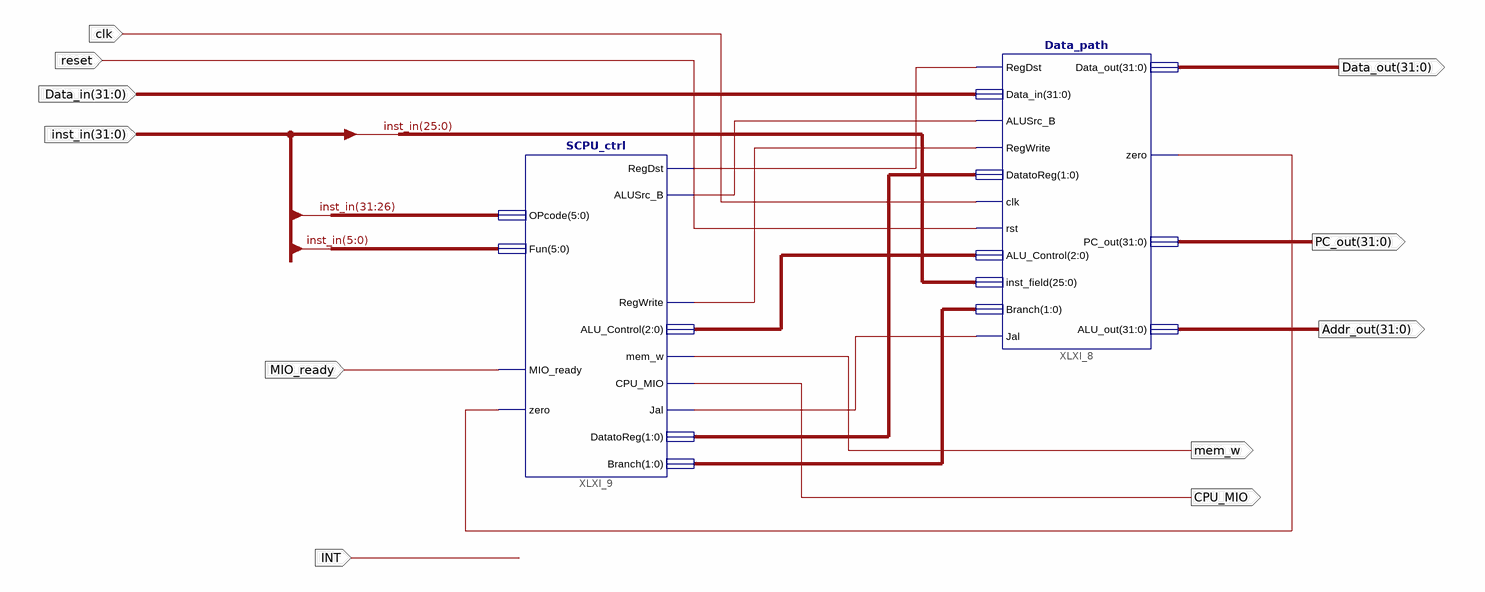
[diagram p0: schematic sheet 1]
// Xilinx ISE schematic SCPU.sch (kintex7) as structural Verilog: 2 symbols, 11 ports
module SCPU (
  input  MIO_ready,
  input  [31:0] inst_in,
  input  [31:0] Data_in,
  input  reset,
  input  INT,
  input  clk,
  output mem_w,
  output CPU_MIO,
  output [31:0] Addr_out,
  output [31:0] PC_out,
  output [31:0] Data_out
);

  wire XLXN_1, XLXN_2, XLXN_6, XLXN_17, XLXN_22;
  wire [1:0] XLXN_23, XLXN_24;
  wire [2:0] XLXN_7;

  Data_path XLXI_8 (
    .RegDst(XLXN_1), .Data_in(Data_in), .ALUSrc_B(XLXN_2), .RegWrite(XLXN_6), .DatatoReg(XLXN_23), .clk(clk),
    .rst(reset), .ALU_Control(XLXN_7), .inst_field(inst_in[25:0]), .Branch(XLXN_24), .Jal(XLXN_22),
    .Data_out(Data_out), .zero(XLXN_17), .PC_out(PC_out), .ALU_out(Addr_out));
  SCPU_ctrl XLXI_9 (
    .MIO_ready(MIO_ready), .OPcode(inst_in[31:26]), .Fun(inst_in[5:0]), .RegDst(XLXN_1), .ALUSrc_B(XLXN_2),
    .RegWrite(XLXN_6), .mem_w(mem_w), .CPU_MIO(CPU_MIO), .ALU_Control(XLXN_7), .zero(XLXN_17), .Jal(XLXN_22),
    .DatatoReg(XLXN_23), .Branch(XLXN_24));
endmodule
